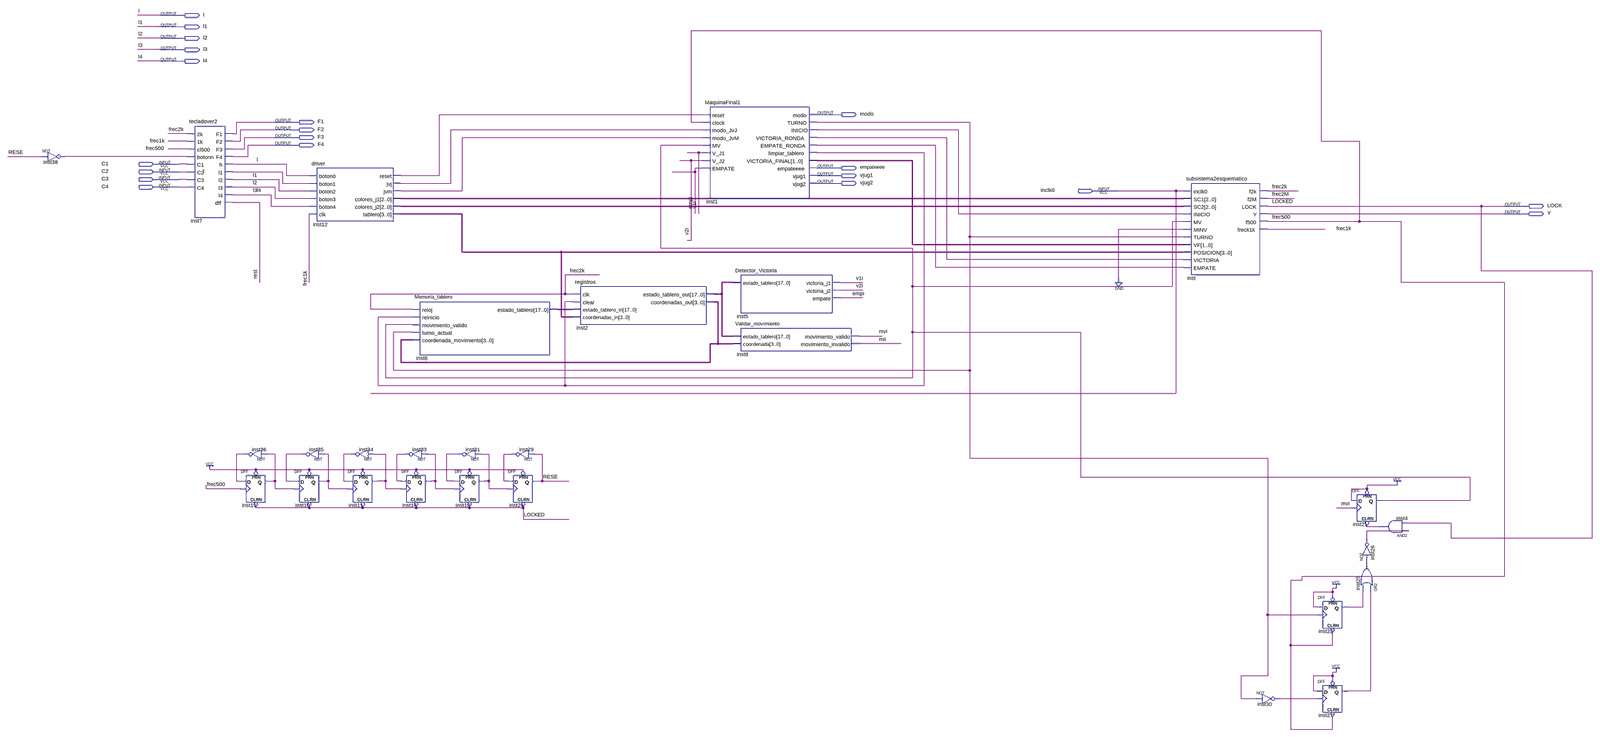
[diagram p0: schematic sheet, whole]
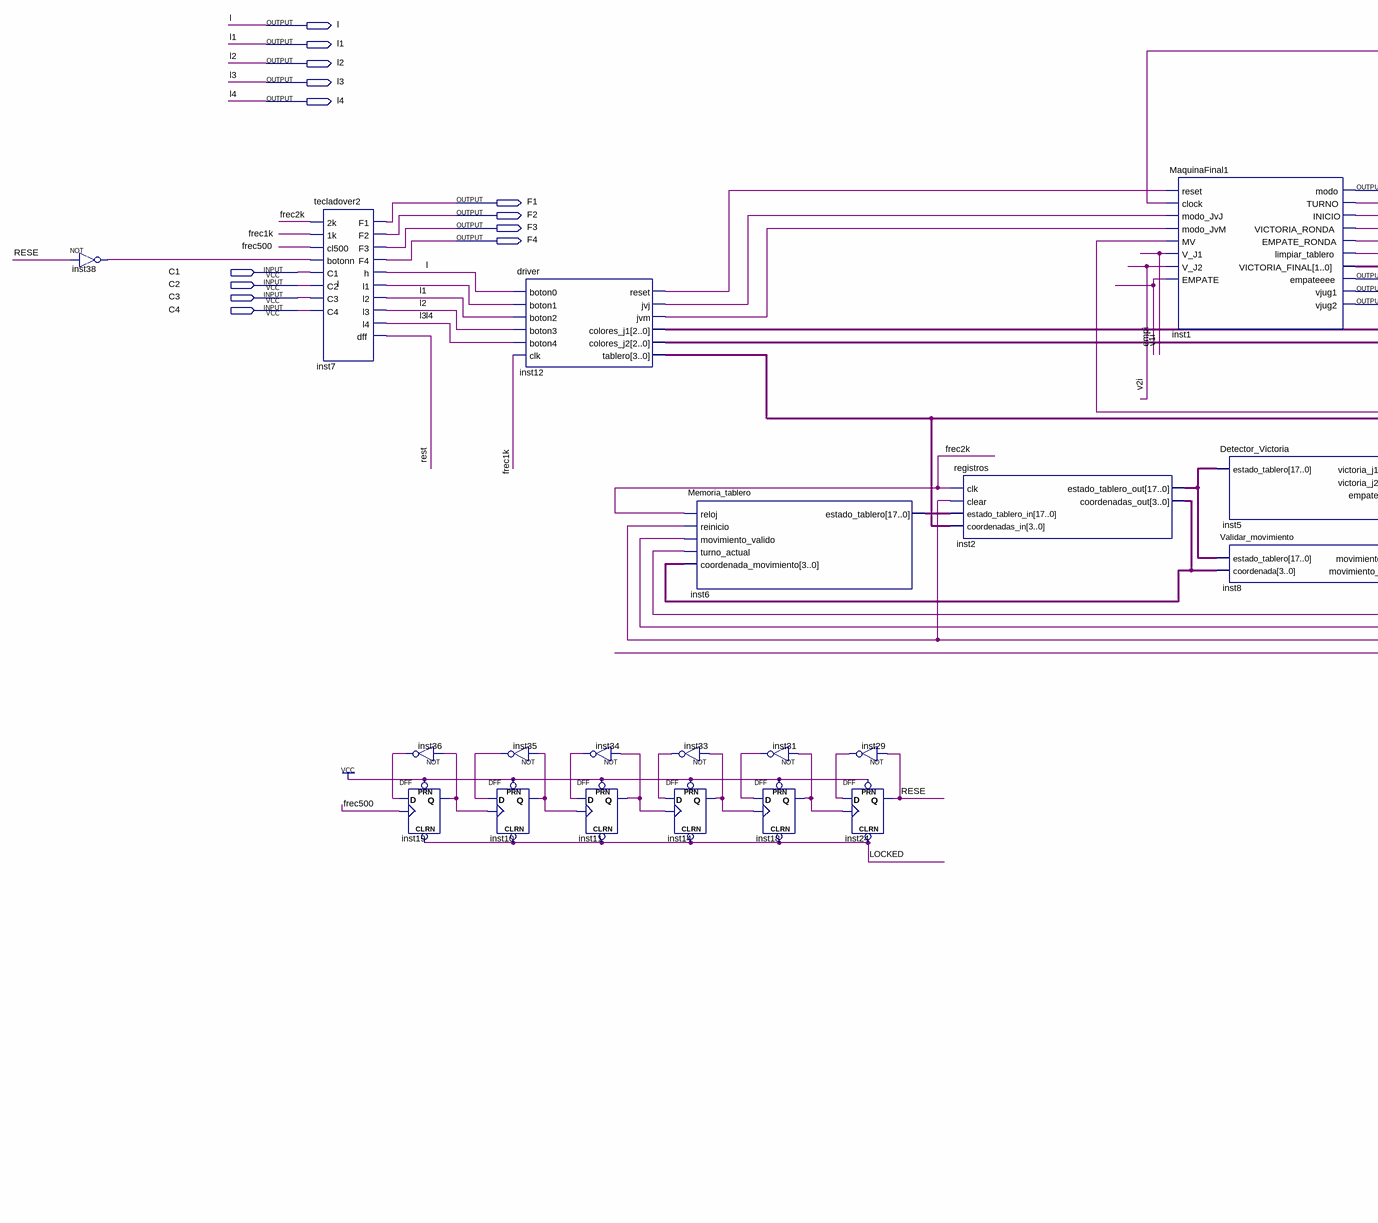
[diagram p1: schematic sheet, left part]
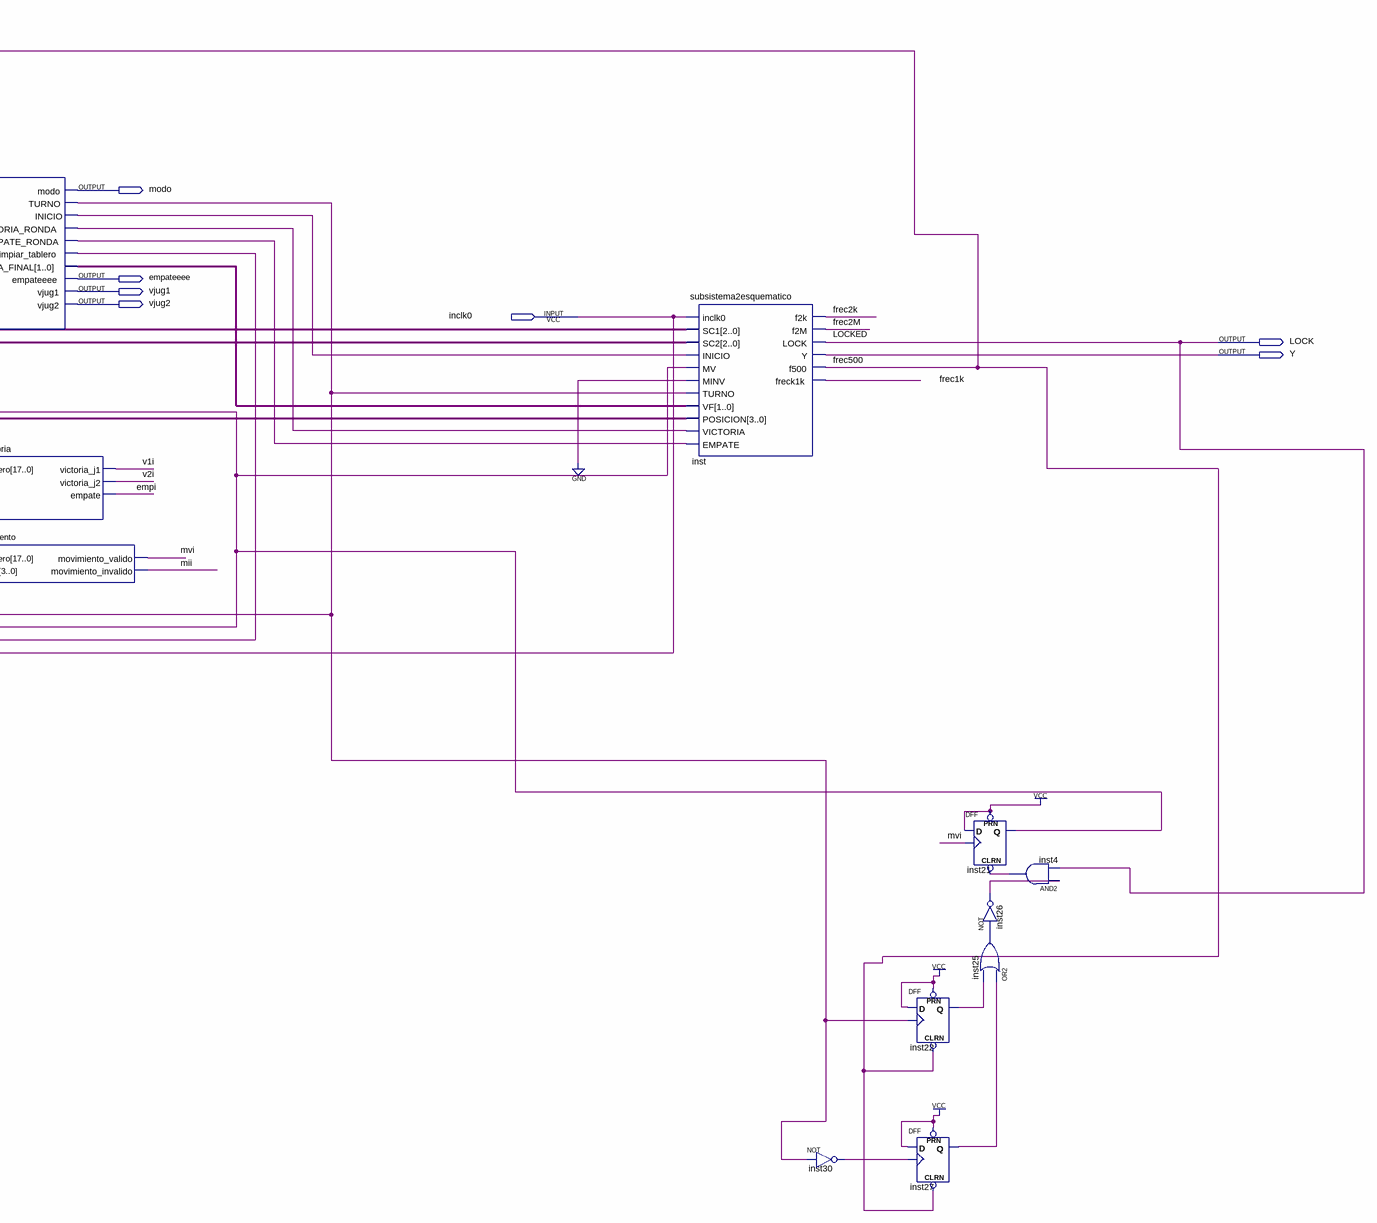
[diagram p2: schematic sheet, right part]
// Quartus schematic proyecto_final.bdf as structural Verilog: 28 symbols, 20 pins
module proyecto_final (
  input  C1,
  input  C2,
  input  C3,
  input  C4,
  input  inclk0,
  output l,
  output l1,
  output l2,
  output l3,
  output l4,
  output modo,
  output F1,
  output F2,
  output F3,
  output F4,
  output empateeee,
  output vjug1,
  output vjug2,
  output LOCK,
  output Y
);

  wire empi, frec1k, frec2k, frec2M, frec500, inst1_empate_ronda, inst1_inicio, inst1_limpiar_tablero,
       inst1_turno, inst1_victoria_ronda, inst4_out, inst10_q, inst11_q, inst12_jvj, inst12_jvm,
       inst12_reset, inst14_q, inst18_q, inst19_q, inst21_q, inst22_q, inst25_out, inst26_out, inst27_q,
       inst29_out, inst30_out, inst31_out, inst33_out, inst34_out, inst35_out, inst36_out, inst38_out, mii,
       mvi, RESE, rest, v1i, v2i;
  wire [1:0] inst1_victoria_final;
  wire [2:0] inst12_colores_j1, inst12_colores_j2;
  wire [3:0] inst2_coordenadas_out, inst12_tablero;
  wire [17:0] inst2_estado_tablero_out, inst6_estado_tablero;

  not inst38 (inst38_out, RESE);
  tecladover2 inst7 (
    .\2k (frec2k), .\1k (frec1k), .cl500(frec500), .botonn(inst38_out), .C1(C1), .C2(C2), .C3(C3), .C4(C4),
    .F1(F1), .F2(F2), .F3(F3), .F4(F4), .h(l), .l1(l1), .l2(l2), .l3(l3), .l4(l4), .dff(rest));
  not inst36 (inst36_out, inst19_q);
  DFF inst19 (.CLRN(LOCK), .CLK(frec500), .D(inst36_out), .PRN(1'b1), .Q(inst19_q));
  driver inst12 (
    .boton0(l), .boton1(l1), .boton2(l2), .boton3(l3), .boton4(l4), .clk(frec1k), .reset(inst12_reset),
    .jvj(inst12_jvj), .jvm(inst12_jvm), .colores_j1(inst12_colores_j1), .colores_j2(inst12_colores_j2),
    .tablero(inst12_tablero));
  not inst35 (inst35_out, inst10_q);
  DFF inst10 (.CLRN(LOCK), .CLK(inst19_q), .D(inst35_out), .PRN(1'b1), .Q(inst10_q));
  not inst34 (inst34_out, inst11_q);
  DFF inst11 (.CLRN(LOCK), .CLK(inst10_q), .D(inst34_out), .PRN(1'b1), .Q(inst11_q));
  Memoria_tablero inst6 (
    .reloj(frec2k), .reinicio(inst1_limpiar_tablero), .movimiento_valido(inst21_q),
    .turno_actual(inst1_turno), .coordenada_movimiento(inst2_coordenadas_out),
    .estado_tablero(inst6_estado_tablero));
  not inst33 (inst33_out, inst14_q);
  DFF inst14 (.CLRN(LOCK), .CLK(inst11_q), .D(inst33_out), .PRN(1'b1), .Q(inst14_q));
  not inst31 (inst31_out, inst18_q);
  DFF inst18 (.CLRN(LOCK), .CLK(inst14_q), .D(inst31_out), .PRN(1'b1), .Q(inst18_q));
  not inst29 (inst29_out, RESE);
  DFF inst24 (.CLRN(LOCK), .CLK(inst18_q), .D(inst29_out), .PRN(1'b1), .Q(RESE));
  registros inst2 (
    .clk(frec2k), .clear(inst1_limpiar_tablero), .estado_tablero_in(inst6_estado_tablero),
    .coordenadas_in(inst12_tablero), .estado_tablero_out(inst2_estado_tablero_out),
    .coordenadas_out(inst2_coordenadas_out));
  MaquinaFinal1 inst1 (
    .reset(inst12_reset), .clock(frec500), .modo_JvJ(inst12_jvj), .modo_JvM(inst12_jvm), .MV(inst21_q),
    .V_J1(v1i), .V_J2(v2i), .EMPATE(empi), .modo(modo), .TURNO(inst1_turno), .INICIO(inst1_inicio),
    .VICTORIA_RONDA(inst1_victoria_ronda), .EMPATE_RONDA(inst1_empate_ronda),
    .limpiar_tablero(inst1_limpiar_tablero), .VICTORIA_FINAL(inst1_victoria_final), .empateeee(empateeee),
    .vjug1(vjug1), .vjug2(vjug2));
  Detector_Victoria inst5 (
    .estado_tablero(inst2_estado_tablero_out), .victoria_j1(v1i), .victoria_j2(v2i), .empate(empi));
  Validar_movimiento inst8 (
    .coordenada(inst2_coordenadas_out), .estado_tablero(inst2_estado_tablero_out), .movimiento_valido(mvi),
    .movimiento_invalido(mii));
  subsistema2esquematico inst (
    .inclk0(inclk0), .SC1(inst12_colores_j1), .SC2(inst12_colores_j2), .INICIO(inst1_inicio), .MV(inst21_q),
    .MINV(1'b0), .TURNO(inst1_turno), .VF(inst1_victoria_final), .POSICION(inst12_tablero),
    .VICTORIA(inst1_victoria_ronda), .EMPATE(inst1_empate_ronda), .f2k(frec2k), .f2M(frec2M), .LOCK(LOCK),
    .Y(Y), .f500(frec500), .freck1k(frec1k));
  not inst30 (inst30_out, inst1_turno);
  DFF inst22 (.CLRN(frec500), .CLK(inst1_turno), .D(1'b1), .PRN(1'b1), .Q(inst22_q));
  DFF inst27 (.CLRN(frec500), .CLK(inst30_out), .D(1'b1), .PRN(1'b1), .Q(inst27_q));
  DFF inst21 (.CLRN(inst4_out), .CLK(mvi), .D(1'b1), .PRN(1'b1), .Q(inst21_q));
  not inst26 (inst26_out, inst25_out);
  or inst25 (inst25_out, inst27_q, inst22_q);
  and inst4 (inst4_out, inst26_out, LOCK);

  // Other names for the same wires on the sheet: LOCKED = LOCK
endmodule
